# Altium schematic sheet 000_Main.SchDoc
size 420 x 297 mm; SheetNumber: 1; SheetTotal: 3; SPICEModelCacheKMNAYMJK: <root> / <DocumentId>KMNAYMJK</DocumentId> / <CacheFrame Number="0"> / <Model Name="0603_150060gs84000" Kind="CKT"> / <Text>****** / .subckt 0603_150060GS84000  1  2 / D1 1 2 SMCW / .MODEL SMCW D / + IS=695.94E-6 / + N=5 / + RS=2.4677 / + IKF=16.109E-12 / + CJO=1.0000E-12 / + M=.3333 / + VJ=.75 / + BV=5 / + IBV=100.00E-6 / + TT=5.0000E-9 / .ends</Text> / </Model> / <Model Name="0603_150060bs75003" Kind="CKT"> / <Text>****** / .subckt 0603_150060BS75003  1  2 / D1 1 2 SMCW / .MODEL SMCW D / + IS=695.94E-6 / + N=5 / + RS=2.4677 / + IKF=16.109E-12 / + CJO=1.0000E-12 / + M=.3333 / + VJ=.75 / + BV=5 / + IBV=10.00E-6 / + TT=5.0000E-9 / .ends</Text> / </Model> / <Model Name="1210_885012209048_4.7uf" Kind="CKT"> / <Text>******* / .subckt 1210_885012209048_4.7uF 1 2 / Rser 1 3 0.00278836774782 / Lser 2 4 2.60340728E-10 / C1 3 4 0.0000047 / Rpar 3 4 20000000 / .ends 1210_885012209048_4.7uF</Text> / </Model> / <Model Name="2220_885012214006_10uf" Kind="CKT"> / <Text>******* / .subckt 2220_885012214006_10uF 1 2 / Rser 1 3 0.003 / Lser 2 4 0.0000000012 / C1 3 4 0.00001 / Rpar 3 4 10000000 / .ends 2220_885012214006_10uF</Text> / </Model> / <Model Name="0805_885012207098r_100nf" Kind="CKT"> / <Text>******* / .subckt 0805_885012207098R_100nF 1 2 / Rser 1 3 0.0175748078756 / Lser 2 4 0.0000000004 / C1 3 4 0.0000001 / Rpar 3 4 5000000000 / .ends 0805_885012207098R_100nF</Text> / </Model> / </CacheFrame> / </root>
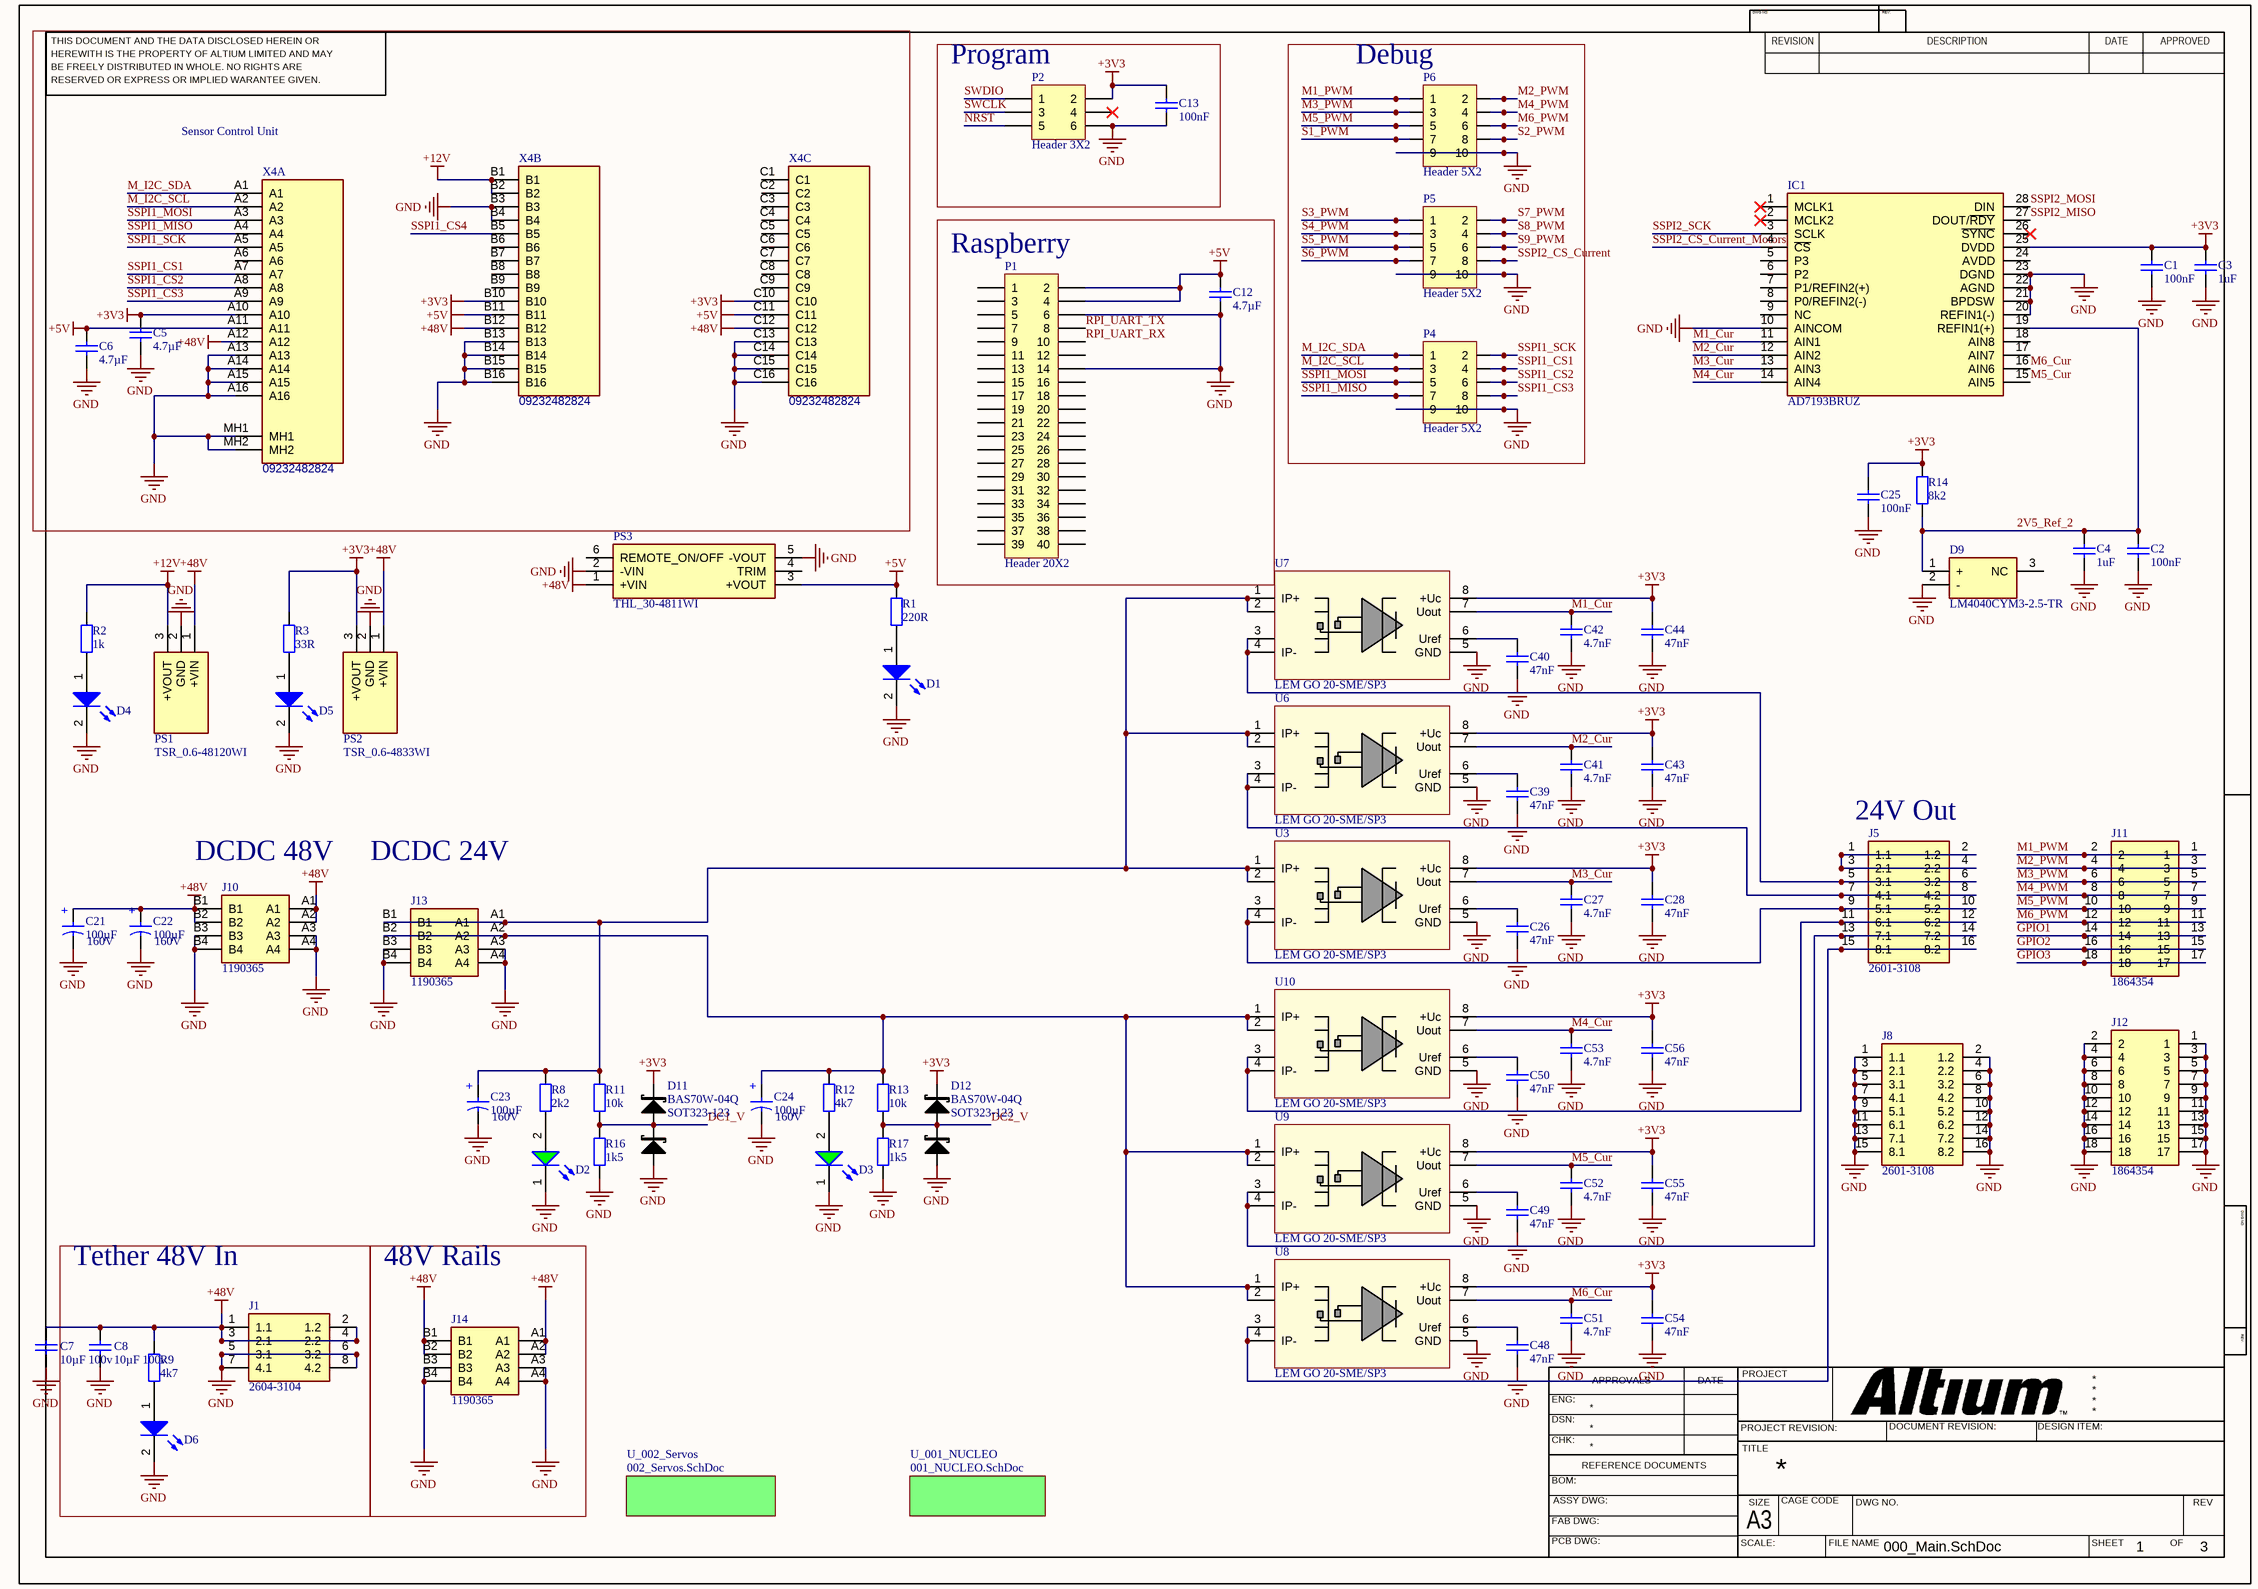
[diagram p0: 000_Main.SchDoc]

## Parts
C1  100nF  [6-0805_L]
C2  100nF  [6-0805_L]
C3  1uF  [6-0805_L]
C4  1uF  [6-0805_L]
C5  4.7µF  [WCAP-CSGP_1210_L3.2W2.5H2.5]
C6  4.7µF  [WCAP-CSGP_1210_L3.2W2.5H2.5]
C7  10µF 100v  [WCAP-CSGP_2220_L5.7W5H2.8]
C8  10µF 100v  [WCAP-CSGP_2220_L5.7W5H2.8]
C12  4.7µF  [WCAP-CSGP_1210_L3.2W2.5H2.5]
C13  100nF  [WCAP-CSGP_0805_L2W1.25H0.8_Reflow]
C21  Rated Voltage (DC): 160V  [WCAP-AT1H_D18H21]  (hidden comment: 100µF)
C22  Rated Voltage (DC): 160V  [WCAP-AT1H_D18H21]  (hidden comment: 100µF)
C23  Rated Voltage (DC): 160V  [WCAP-AT1H_D18H21]  (hidden comment: 100µF)
C24  Rated Voltage (DC): 160V  [WCAP-AT1H_D18H21]  (hidden comment: 100µF)
C25  100nF  [6-0805_L]
C26  47nF  [WCAP-CSGP_0805_L2W1.25H0.8_Reflow]
C27  4.7nF  [WCAP-CSGP_0805_L2W1.25H0.8_Reflow]
C28  47nF  [WCAP-CSGP_0805_L2W1.25H0.8_Reflow]
C39  47nF  [WCAP-CSGP_0805_L2W1.25H0.8_Reflow]
C40  47nF  [WCAP-CSGP_0805_L2W1.25H0.8_Reflow]
C41  4.7nF  [WCAP-CSGP_0805_L2W1.25H0.8_Reflow]
C42  4.7nF  [WCAP-CSGP_0805_L2W1.25H0.8_Reflow]
C43  47nF  [WCAP-CSGP_0805_L2W1.25H0.8_Reflow]
C44  47nF  [WCAP-CSGP_0805_L2W1.25H0.8_Reflow]
C48  47nF  [WCAP-CSGP_0805_L2W1.25H0.8_Reflow]
C49  47nF  [WCAP-CSGP_0805_L2W1.25H0.8_Reflow]
C50  47nF  [WCAP-CSGP_0805_L2W1.25H0.8_Reflow]
C51  4.7nF  [WCAP-CSGP_0805_L2W1.25H0.8_Reflow]
C52  4.7nF  [WCAP-CSGP_0805_L2W1.25H0.8_Reflow]
C53  4.7nF  [WCAP-CSGP_0805_L2W1.25H0.8_Reflow]
C54  47nF  [WCAP-CSGP_0805_L2W1.25H0.8_Reflow]
C55  47nF  [WCAP-CSGP_0805_L2W1.25H0.8_Reflow]
C56  47nF  [WCAP-CSGP_0805_L2W1.25H0.8_Reflow]
D1  Blue, 3.2V, 140°  [WL-SMCW_0603_150060xx75003]  (value not drawn)
D2  Green, 3.3V, 40°  [WL-SMCW_0603_150060xx8x000]  (value not drawn)
D3  Green, 3.3V, 40°  [WL-SMCW_0603_150060xx8x000]  (value not drawn)
D4  Blue, 3.2V, 140°  [WL-SMCW_0603_150060xx75003]  (value not drawn)
D5  Blue, 3.2V, 140°  [WL-SMCW_0603_150060xx75003]  (value not drawn)
D6  Blue, 3.2V, 140°  [WL-SMCW_0603_150060xx75003]  (value not drawn)
D9  LM4040CYM3-2.5-TR  [SOT - 23]
D11  BAS70W-04Q  [SOT323-123]
D12  BAS70W-04Q  [SOT323-123]
IC1  AD7193BRUZ  [SOP65P640X120-28N]
J1  2604-3104  [26043104]
J5  2601-3108  [26013108]
J8  2601-3108  [26013108]
J10  1190365  [1190365]
J11  1864354  [1864354]
J12  1864354  [1864354]
J13  1190365  [1190365]
J14  1190365  [1190365]
P1  Header 20X2  [HDR2X20]
P2  Header 3X2  [HDR2X3]
P4  Header 5X2  [HDR2X5]
P5  Header 5X2  [HDR2X5]
P6  Header 5X2  [HDR2X5]
PS1  TSR_0.6-48120WI  [TSR0648120WI]
PS2  TSR_0.6-4833WI  [TSR0648120WI]
PS3  THL_30-4811WI  [THL304811WI]
R1  220R  [6-0805_M]
R2  1k  [6-0805_M]
R3  33R  [6-0805_M]
R8  2k2  [6-0805_M]
R9  4k7  [6-0805_M]
R11  10k  [6-0805_M]
R12  4k7  [6-0805_M]
R13  10k  [6-0805_M]
R14  8k2  [6-0805_M]
R16  1k5  [6-0805_M]
R17  1k5  [6-0805_M]
U3  LEM GO 20-SME/SP3  [Lem_sme_SOIC8]
U6  LEM GO 20-SME/SP3  [Lem_sme_SOIC8]
U7  LEM GO 20-SME/SP3  [Lem_sme_SOIC8]
U8  LEM GO 20-SME/SP3  [Lem_sme_SOIC8]
U9  LEM GO 20-SME/SP3  [Lem_sme_SOIC8]
U10  LEM GO 20-SME/SP3  [Lem_sme_SOIC8]
X4  09232482824  [09232482824]  (parts A,B,C of 3)

## Blocks framed on the sheet
Sensor Control Unit: C5 C6 X4
Program: C13 P2
Debug: P4-P6
Raspberry: C12 P1
Tether 48V In: C8 D6 J1 R9
48V Rails: J14

## Sub-sheets
U_001_NUCLEO = 001_NUCLEO.SchDoc: no entries
U_002_Servos = 002_Servos.SchDoc: no entries

## Nets
+3V3: C1.2 C3.2 C5.2 C13.1 C25.2 C28.2 C43.2 C44.2 C54.2 C55.2 C56.2 D11.2 D12.2 IC1.25(DVDD) P2.2 PS2.3(+VOUT) R3.2 R14.2 U3.8(+Uc) U6.8(+Uc) U7.8(+Uc) U8.8(+Uc) U9.8(+Uc) U10.8(+Uc) X4.A10 X4.B10 X4.C10
+5V: C6.2 C12.2 P1.2 P1.4 PS3.3(+VOUT) R1.2 X4.A11 X4.B11 X4.C11
+12V: PS1.3(+VOUT) R2.2 X4.B1 X4.B2
+48V: C7.2 C8.2 C21.1(P) C22.1(P) J1.1(1.1) J1.2(1.2) J1.3(2.1) J1.4(2.2) J10.A1 J10.A2 J10.B1 J10.B2 J14.A1 J14.A2 J14.B1 J14.B2 PS1.1(+VIN) PS2.1(+VIN) PS3.1(+VIN) R9.2 X4.A12 X4.B12 X4.C12
GND: C1.1 C2.1 C3.1 C4.1 C5.1 C6.1 C7.1 C8.1 C12.1 C13.2 C21.2(N) C22.2(N) C23.2(N) C24.2(N) C25.1 C26.1 C27.1 C28.1 C39.1 C40.1 C41.1 C42.1 C43.1 C44.1 C48.1 C49.1 C50.1 C51.1 C52.1 C53.1 C54.1 C55.1 C56.1 D1.2(K) D2.1(K) D3.1(K) D4.2(K) D5.2(K) D6.2(K) D9.2(-) D11.1 D12.1 IC1.10(AINCOM) IC1.20(REFIN1(-)) IC1.21(BPDSW) IC1.22(AGND) IC1.23(DGND) J1.5(3.1) J1.6(3.2) J1.7(4.1) J1.8(4.2) J8.1(1.1) J8.2(1.2) J8.3(2.1) J8.4(2.2) J8.5(3.1) J8.6(3.2) J8.7(4.1) J8.8(4.2) J8.9(5.1) J8.10(5.2) J8.11(6.1) J8.12(6.2) J8.13(7.1) J8.14(7.2) J8.15(8.1) J8.16(8.2) J10.A3 J10.A4 J10.B3 J10.B4 J12.1 J12.2 J12.3 J12.4 J12.5 J12.6 J12.7 J12.8 J12.9 J12.10 J12.11 J12.12 J12.13 J12.14 J12.15 J12.16 J12.17 J12.18 J13.A3 J13.A4 J13.B3 J13.B4 J14.A3 J14.A4 J14.B3 J14.B4 P1.6 P1.14 P2.6 P4.9 P4.10 P5.9 P5.10 P6.9 P6.10 PS1.2(GND) PS2.2(GND) PS3.2(-VIN) PS3.5(-VOUT) R16.1 R17.1 U3.5(GND) U6.5(GND) U7.5(GND) U8.5(GND) U9.5(GND) U10.5(GND) X4.A13 X4.A14 X4.A15 X4.A16 X4.B3 X4.B4 X4.B13 X4.B14 X4.B15 X4.B16 X4.C13 X4.C14 X4.C15 X4.C16 X4.MH1 X4.MH2
2V5_Ref_2: C2.2 C4.2 D9.1(+) IC1.19(REFIN1(+)) R14.1
DC1_V: D11.3 R11.1 R16.2
DC2_V: D12.3 R13.1 R17.2
GPIO1: J11.13 J11.14
GPIO2: J11.15 J11.16
GPIO3: J11.17 J11.18
M1_Cur: C42.2 IC1.11(AIN1) U7.7(Uout)
M1_PWM: J11.1 J11.2 P6.1
M2_Cur: C41.2 IC1.12(AIN2) U6.7(Uout)
M2_PWM: J11.3 J11.4 P6.2
M3_Cur: C27.2 IC1.13(AIN3) U3.7(Uout)
M3_PWM: J11.5 J11.6 P6.3
M4_Cur: C53.2 IC1.14(AIN4) U10.7(Uout)
M4_PWM: J11.7 J11.8 P6.4
M5_Cur: C52.2 IC1.15(AIN5) U9.7(Uout)
M5_PWM: J11.9 J11.10 P6.5
M6_Cur: C51.2 IC1.16(AIN6) U8.7(Uout)
M6_PWM: J11.11 J11.12 P6.6
M_I2C_SCL: P4.3 X4.A2
M_I2C_SDA: P4.1 X4.A1
NRST: P2.5
RPI_UART_RX: P1.10
RPI_UART_TX: P1.8
S1_PWM: P6.7
S2_PWM: P6.8
S3_PWM: P5.1
S4_PWM: P5.3
S5_PWM: P5.5
S6_PWM: P5.7
S7_PWM: P5.2
S8_PWM: P5.4
S9_PWM: P5.6
SSPI1_CS1: P4.4 X4.A7
SSPI1_CS2: P4.6 X4.A8
SSPI1_CS3: P4.8 X4.A9
SSPI1_CS4: X4.B5
SSPI1_MISO: P4.7 X4.A4
SSPI1_MOSI: P4.5 X4.A3
SSPI1_SCK: P4.2 X4.A5
SSPI2_CS_Current: P5.8
SSPI2_CS_Current_Motors: IC1.4(~{CS})
SSPI2_MISO: IC1.27(DOUT/~{RDY})
SSPI2_MOSI: IC1.28(DIN)
SSPI2_SCK: IC1.3(SCLK)
SWCLK: P2.3
SWDIO: P2.1
NetC23_1: C23.1(P) J13.A1 J13.B1 R8.2 R11.2 U3.1(IP+) U3.2 U6.1(IP+) U6.2 U7.1(IP+) U7.2
NetC24_1: C24.1(P) J13.A2 J13.B2 R12.2 R13.2 U8.1(IP+) U8.2 U9.1(IP+) U9.2 U10.1(IP+) U10.2
NetC26_2: C26.2 U3.6(Uref)
NetC39_2: C39.2 U6.6(Uref)
NetC40_2: C40.2 U7.6(Uref)
NetC48_2: C48.2 U8.6(Uref)
NetC49_2: C49.2 U9.6(Uref)
NetC50_2: C50.2 U10.6(Uref)
NetD1_1: D1.1(A) R1.1
NetD2_2: D2.2(A) R8.1
NetD3_2: D3.2(A) R12.1
NetD4_1: D4.1(A) R2.1
NetD5_1: D5.1(A) R3.1
NetD6_1: D6.1(A) R9.1
NetJ5_1: J5.1(1.1) J5.2(1.2) J5.3(2.1) J5.4(2.2)
NetJ5_5: J5.5(3.1) J5.6(3.2) U7.3 U7.4(IP-)
NetJ5_7: J5.7(4.1) J5.8(4.2) U6.3 U6.4(IP-)
NetJ5_9: J5.9(5.1) J5.10(5.2) U3.3 U3.4(IP-)
NetJ5_11: J5.11(6.1) J5.12(6.2) U10.3 U10.4(IP-)
NetJ5_13: J5.13(7.1) J5.14(7.2) U9.3 U9.4(IP-)
NetJ5_15: J5.15(8.1) J5.16(8.2) U8.3 U8.4(IP-)

Not connected (* = marked no-connect by the designer): D9 3(NC); IC1 1(MCLK1)* 2(MCLK2)* 5(P3) 6(P2) 7(P1/REFIN2(+)) 8(P0/REFIN2(-)) 9(NC) 17(AIN7) 18(AIN8) 24(AVDD) 26(~{SYNC})*; P1 1 3 5 7 9 11 12 13 15 16 17 18 19 20 21 22 23 24 25 26 27 28 29 30 31 32 33 34 35 36 37 38 39 40; P2 4*; PS3 4(TRIM) 6(REMOTE_ON/OFF); X4 A6 B6 B7 B8 B9 C1 C2 C3 C4 C5 C6 C7 C8 C9

## Notes on the sheet
- (near J10) DCDC 48V
- DCDC 24V
- (near J5) 24V Out
- THIS DOCUMENT AND THE DATA DISCLOSED HEREIN OR
- HEREWITH IS THE PROPERTY OF ALTIUM LIMITED AND MAY
- DWG NO:
- REVISION
- REV:
- DESCRIPTION
- DATE
- APPROVED
- BE FREELY DISTRIBUTED IN WHOLE. NO RIGHTS ARE
- RESERVED OR EXPRESS OR IMPLIED WARANTEE GIVEN.
- ENG:
- APPROVALS
- PROJECT
- DSN:
- CHK:
- REFERENCE DOCUMENTS
- PROJECT REVISION:
- TITLE
- DOCUMENT REVISION:
- DESIGN ITEM:
- BOM:
- FAB DWG:
- PCB DWG:
- ASSY DWG:
- SCALE:
- A3
- SIZE
- CAGE CODE
- FILE NAME
- DWG NO.
- SHEET
- OF
- REV
- (in symbol 860240981006) +

## Library data of the parts
C1-C4 C25 = Cap: Capacitor; Published: 8-Jun-2000; LatestRevisionDate: 17-Jul-2002; LatestRevisionNote: Re-released for DXP Platform.; PackageReference: RAD-0.3; Publisher: Altium Limited; PackageDescription: Radial Cap, Thru-Hole; 2 Leads; 0.3 in Pin Spacing
  C1 C2 C25: Value: 100nF
  C3 C4: Value: 1uF
C5 C6 C12 = 885012209048: WCAP-CSGP Multilayer Ceramic Chip Capacitor, General Purpose, size 1210, X7R, 4.7µF, 50VDC; Manufacturer: Wurth Elektronik; Case/Size Code: 1210; Capacitance Tolerance: +/-10%; Dissipation Factor: 5%; Insulation Resistance: 0.02GΩ; Rated Voltage (DC): 50V; Technical Reference: X7R1210475K050DFCT10000; Manufacturer Part Number: 885012209048; Category: Multilayer Ceramic Chip Capacitors; Match Code: WCAP-CSGP; ComponentLink1Description: Website Link; ComponentLink1URL: https://www.we-online.com/redexpert/article/885012209048?ad; ComponentLink2Description: Datasheet Link; ComponentLink2URL: https://www.we-online.com/redexpert/spec/885012209048?ad; Mount: Surface Mount; Operating Temperature Max: 125°C; Operating Temperature Min: -55°C; Packaging: Tape and Reel; Length: 3.2mm; Width: 2.5mm; Height: 2.5mm; Capacitance: 4.7µF; Ceramic Type: X7R
C7 C8 = 885012214006: WCAP-CSGP Multilayer Ceramic Chip Capacitor, General Purpose, size 2220, X7R Class II, 10µF, 100VDC; Manufacturer: Wurth Elektronik; Case/Size Code: 2220; Capacitance Tolerance: +/-10%; Dissipation Factor: 2.5%; Insulation Resistance: 0.01GΩ; Technical Reference: X7R2220106K100DFCT10000; Manufacturer Part Number: 885012214006; Category: Multilayer Ceramic Chip Capacitors; Match Code: WCAP-CSGP; ComponentLink1Description: Website Link; ComponentLink1URL: https://www.we-online.com/redexpert/article/885012214006?ad; ComponentLink2Description: Datasheet Link; ComponentLink2URL: https://www.we-online.com/redexpert/spec/885012214006?ad; Mount: Surface Mount; Operating Temperature Max: 125°C; Operating Temperature Min: -55°C; Packaging: Tape and Reel; Length: 5.7mm; Width: 5mm; Height: 2.8mm; Capacitance: 10µF 100v; Ceramic Type: X7R Class II; Rated Voltage (DC): 100V
C13 = 885012207098R: WCAP-CSGP Multilayer Ceramic Chip Capacitor, General Purpose, size 0805, X7R, 100nF, 50VDC; Manufacturer: Wurth Elektronik; Case/Size Code: 0805; Capacitance Tolerance: +/-10%; Dissipation Factor: 2.5%; Insulation Resistance: 5GΩ; Rated Voltage (DC): 50V; Technical Reference: X7R0805104K050DFCT20000; Manufacturer Part Number: 885012207098R; Category: Multilayer Ceramic Chip Capacitors; Match Code: WCAP-CSGP; ComponentLink1Description: Website Link; ComponentLink1URL: https://www.we-online.com/redexpert/article/885012207098R?ad; ComponentLink2Description: Datasheet Link; ComponentLink2URL: https://www.we-online.com/redexpert/spec/885012207098R?ad; Mount: Surface Mount; Operating Temperature Max: 125°C; Operating Temperature Min: -55°C; Packaging: Tape and Reel; Length: 2mm; Width: 1.25mm; Height: 0.8mm; Capacitance: 100nF; Ceramic Type: X7R
C21-C24 = 860240981006: WCAP-AT1H Aluminum Electrolytic Capacitor, Radial, THT, D18 x H21mm, 100µF, 160V; Manufacturer: Wurth Elektronik; Capacitance Tolerance: +/-20%; Dissipation Factor: 15%; Endurance: 10000h; Leakage Current: 740µA; Ripple Current: 1310mA; Technical Reference: ATDL210101M160DSPAEK000; Manufacturer Part Number: 860240981006; Category: Aluminum Electrolytic Capacitors; Match Code: WCAP-AT1H; ComponentLink1Description: Website Link; ComponentLink1URL: https://www.we-online.com/redexpert/article/860240981006?ad; ComponentLink2Description: Datasheet Link; ComponentLink2URL: https://www.we-online.com/redexpert/spec/860240981006?ad; Mount: Through Hole; Operating Temperature Max: 105°C; Operating Temperature Min: -40°C; Packaging: Ammo Pack; Height: 21mm; Diameter: 18mm; Capacitance: 100µF
C26 C28 C39 C40 C43 C44 C48-C50 C54-C56 = 885012207096: WCAP-CSGP Multilayer Ceramic Chip Capacitor, General Purpose, size 0805, X7R, 47nF, 50VDC; Manufacturer: Wurth Elektronik; Case/Size Code: 0805; Capacitance Tolerance: +/-10%; Dissipation Factor: 2.5%; Insulation Resistance: 10GΩ; Rated Voltage (DC): 50V; Technical Reference: X7R0805473K050DFCT10000; Manufacturer Part Number: 885012207096; Category: Multilayer Ceramic Chip Capacitors; Match Code: WCAP-CSGP; ComponentLink1Description: Website Link; ComponentLink1URL: https://www.we-online.com/redexpert/article/885012207096?ad; ComponentLink2Description: Datasheet Link; ComponentLink2URL: https://www.we-online.com/redexpert/spec/885012207096?ad; Mount: Surface Mount; Operating Temperature Max: 125°C; Operating Temperature Min: -55°C; Packaging: Tape and Reel; Length: 2mm; Width: 1.25mm; Height: 0.8mm; Capacitance: 47nF; Ceramic Type: X7R
C27 C41 C42 C51-C53 = 885012207090: WCAP-CSGP Multilayer Ceramic Chip Capacitor, General Purpose, size 0805, X7R, 4.7nF, 50VDC; Manufacturer: Wurth Elektronik; Case/Size Code: 0805; Capacitance Tolerance: +/-10%; Dissipation Factor: 2.5%; Insulation Resistance: 10GΩ; Rated Voltage (DC): 50V; Technical Reference: X7R0805472K050DFCT10000; Manufacturer Part Number: 885012207090; Category: Multilayer Ceramic Chip Capacitors; Match Code: WCAP-CSGP; ComponentLink1Description: Website Link; ComponentLink1URL: https://www.we-online.com/redexpert/article/885012207090?ad; ComponentLink2Description: Datasheet Link; ComponentLink2URL: https://www.we-online.com/redexpert/spec/885012207090?ad; Mount: Surface Mount; Operating Temperature Max: 125°C; Operating Temperature Min: -55°C; Packaging: Tape and Reel; Length: 2mm; Width: 1.25mm; Height: 0.8mm; Capacitance: 4.7nF; Ceramic Type: X7R
D1 D4-D6 = 150060BS75003: WL-SMCW Mono-color Chip LED Waterclear, size 0603, Blue, 3.2V, 140°; Manufacturer: Wurth Elektronik; Case/Size Code: 0603; Chip Technology: InGaN; Dominant Wavelength: 470nm; Luminous Intensity: 350mcd; Peak Wavelength: 465nm; Manufacturer Part Number: 150060BS75003; Category: Signal LEDs; Match Code: WL-SMCW; ComponentLink1Description: Website Link; ComponentLink1URL: https://www.we-online.com/redexpert/article/150060BS75003?ad; ComponentLink2Description: Datasheet Link; ComponentLink2URL: https://www.we-online.com/redexpert/spec/150060BS75003?ad; Mount: Surface Mount; Operating Temperature Max: 100°C; Operating Temperature Min: -40°C; Packaging: Tape and Reel; Length: 1.6mm; Width: 0.8mm; Height: 0.7mm; Emitting Color: Blue; Forward Voltage: 3.2V; Viewing Angle: 140°
D2 D3 = 150060GS84000: WL-SMCW Mono-color Chip LED Waterclear, size 0603, Green, 3.3V, 40°; Manufacturer: Wurth Elektronik; Case/Size Code: 0603; Chip Technology: InGaN; Dominant Wavelength: 525nm; Luminous Intensity: 3000mcd; Peak Wavelength: 520nm; Manufacturer Part Number: 150060GS84000; Category: Signal LEDs; Match Code: WL-SMCW; ComponentLink1Description: Website Link; ComponentLink1URL: https://www.we-online.com/redexpert/article/150060GS84000?ad; ComponentLink2Description: Datasheet Link; ComponentLink2URL: https://www.we-online.com/redexpert/spec/150060GS84000?ad; Mount: Surface Mount; Operating Temperature Max: 85°C; Operating Temperature Min: -40°C; Packaging: Tape and Reel; Length: 1.6mm; Width: 0.8mm; Height: 0.95mm; Emitting Color: Green; Forward Voltage: 3.3V; Viewing Angle: 40°
D9 = LM4040CYM3-2.5-TR: Integrated Circuit; Manufacturer_Name: Microchip; Datasheet Link: https://componentsearchengine.com/Datasheets/1/LM4040CYM3-2.5-TR.pdf; Height: 1.11mm; Manufacturer_Part_Number: LM4040CYM3-2.5-TR; Mouser Part Number: 998-LM4040CYM3-2.5TR; Mouser Price/Stock: https://www.mouser.co.uk/ProductDetail/Microchip-Technology/LM4040CYM3-2.5-TR?qs=Y3Q3JoKAO1TBY3WS5dYgqA%3D%3D; Arrow Part Number: LM4040CYM3-2.5-TR; Arrow Price/Stock: https://www.arrow.com/en/products/lm4040cym3-2.5-tr/microchip-technology?region=nac
D11 D12 = Dual Schottky Diode: DUAL SCHOTTKY DIODE SERIES; Model: BAS70W-04Q
IC1 = AD7193BRUZ: Integrated Circuit; Manufacturer_Name: Analog Devices; Datasheet Link: https://www.arrow.com/en/products/ad7193bruz/analog-devices; Height: 1.2mm; Manufacturer_Part_Number: AD7193BRUZ; Mouser Part Number: 584-AD7193BRUZ; Mouser Price/Stock: https://www.mouser.co.uk/ProductDetail/Analog-Devices/AD7193BRUZ?qs=NmRFExCfTkGSEOyDxDZl1A%3D%3D; Arrow Part Number: AD7193BRUZ; Arrow Price/Stock: https://www.arrow.com/en/products/ad7193bruz/analog-devices?region=nac
J1 = 2604-3104: PCB terminal block; lever; 4 mm; Pin spacing 5 mm; 4-pole; Push-in CAGE CLAMP; Manufacturer_Name: Wago; Geometry.Height: 21.3mm; Manufacturer_Part_Number: 2604-3104; Mouser Part Number: *; Mouser Price/Stock: *; Arrow Part Number: 2604-3104; Arrow Price/Stock: https://www.arrow.com/en/products/2604-3104/wago-kontakttechnik-gmbh?region=nac; Datasheet Link: https://www.wago.com/2604-3104
J5 J8 = 2601-3108: Connector; Manufacturer_Name: Wago; Datasheet Link: https://www.wago.com/2601-3108; Height: 16.58mm; Manufacturer_Part_Number: 2601-3108
J10 J13 J14 = 1190365: Fixed Terminal Blocks LPTA 2,5/ 4-5,0; Manufacturer_Name: Phoenix Contact; Geometry.Height: 22.65mm; Mouser Part Number: 651-1190365; Mouser Price/Stock: https://www.mouser.co.uk/ProductDetail/Phoenix-Contact/1190365?qs=QNEnbhJQKvbYhaie4VzA2g%3D%3D; Manufacturer_Part_Number: 1190365; Datasheet Link: http://www.phoenixcontact.net/product/1190365
J11 J12 = 1864354: Conn Terminal Block 9 POS 3.5mm Spring Clamp Thru-Hole 13.5A; Manufacturer_Name: Phoenix Contact; Geometry.Height: 10.9mm; Manufacturer_Part_Number: 1864354; Mouser Part Number: 651-1864354; Mouser Price/Stock: https://www.mouser.co.uk/ProductDetail/Phoenix-Contact/1864354?qs=K5ytOU5dogooOTFQbYZG6w%3D%3D; Arrow Part Number: 1864354; Arrow Price/Stock: https://www.arrow.com/en/products/1864354/phoenix-contact; Datasheet Link: https://datasheet.datasheetarchive.com/originals/distributors/DKDS-31/613782.pdf
P1 = Header 20X2: Header, 20-Pin, Dual row; LatestRevisionDate: 17-Jul-2002; LatestRevisionNote: Re-released for DXP Platform.; Publisher: Altium Limited
P2 = Header 3X2: Header, 3-Pin, Dual row; LatestRevisionDate: 17-Jul-2002; LatestRevisionNote: Re-released for DXP Platform.; Publisher: Altium Limited
P4-P6 = Header 5X2: Header, 5-Pin, Dual row; LatestRevisionDate: 17-Jul-2002; LatestRevisionNote: Re-released for DXP Platform.; Publisher: Altium Limited
PS1 = TSR_0.6-48120WI: Power Supply; Manufacturer_Name: Traco Power; Manufacturer_Part_Number: TSR 0.6-48120WI; Datasheet Link: https://tracopower.com/tsr0-6wi-datasheet/; Height: 13.4mm; Mouser Part Number: 495-TSR0.6-48120WI; Mouser Price/Stock: https://www.mouser.co.uk/ProductDetail/TRACO-Power/TSR-0.6-48120WI?qs=XeJtXLiO41RYifRYPPRcXw%3D%3D
PS2 = TSR_0.6-4833WI: Power Supply; Manufacturer_Name: Traco Power; Manufacturer_Part_Number: TSR 0.6-4833WI; Datasheet Link: https://tracopower.com/tsr0-6wi-datasheet/; Height: 13.4mm; Mouser Part Number: 495-TSR0.6-4833WI; Mouser Price/Stock: https://www.mouser.co.uk/ProductDetail/TRACO-Power/TSR-06-4833WI?qs=XeJtXLiO41TOoSnX4kC9jQ%3D%3D
PS3 = THL_30-4811WI: Power Supply; Manufacturer_Name: Traco Power; Manufacturer_Part_Number: THL 30-4811WI; Datasheet Link: https://tracopower.com/thl30wi-datasheet/; Height: 10.7mm; Mouser Part Number: 495-THL30-4811WI; Mouser Price/Stock: https://www.mouser.co.uk/ProductDetail/TRACO-Power/THL-30-4811WI?qs=Y0Uzf4wQF3nJ2IvHzeZgKg%3D%3D
R1-R3 R8 R9 R11-R14 R16 R17 = Res2: Resistor; Published: 8-Jun-2000; LatestRevisionDate: 17-Jul-2002; LatestRevisionNote: Re-released for DXP Platform.; PackageReference: AXIAL-0.4; Publisher: Altium Limited; PackageDescription: Axial Device, Thru-Hole; 2 Leads; 0.4 in Pin Spacing
  R1: Value: 220R
  R2: Value: 1k
  R3: Value: 33R
  R8: Value: 2k2
  R9 R12: Value: 4k7
  R11 R13: Value: 10k
  R14: Value: 8k2
  R16 R17: Value: 1k5
U3 U6-U10 = LEM_SME: Integrated Current Transducer GO-SME s; ComponentLink1Description: Datasheet; ComponentLink1URL: https://www.lem.com/sites/default/files/products_datasheets/go-sme_series.pdf; Manufacturer: LEM; Ordering Number: GO 20-SME/SP3
X4 = 09232482824: DIN 2C female straight 48pin, 2.9mm tails, PL1; Manufacturer: HARTING; Geometry.Height: 11.6mm; Ordering Number: 09232482824; Mouser Part Number: 617-09232482824; Mouser Price/Stock: https://www.mouser.co.uk/ProductDetail/HARTING/09232482824?qs=Afqhj6cPmO8bPFy5EsJjEQ%3D%3D; Arrow Part Number: *; Arrow Price/Stock: *; Datasheet Link: https://b2b.harting.com/files/download/PRD/PDF_DS/PDF_DS_09032100001.pdf